# Altium project TimePi.PrjPcb
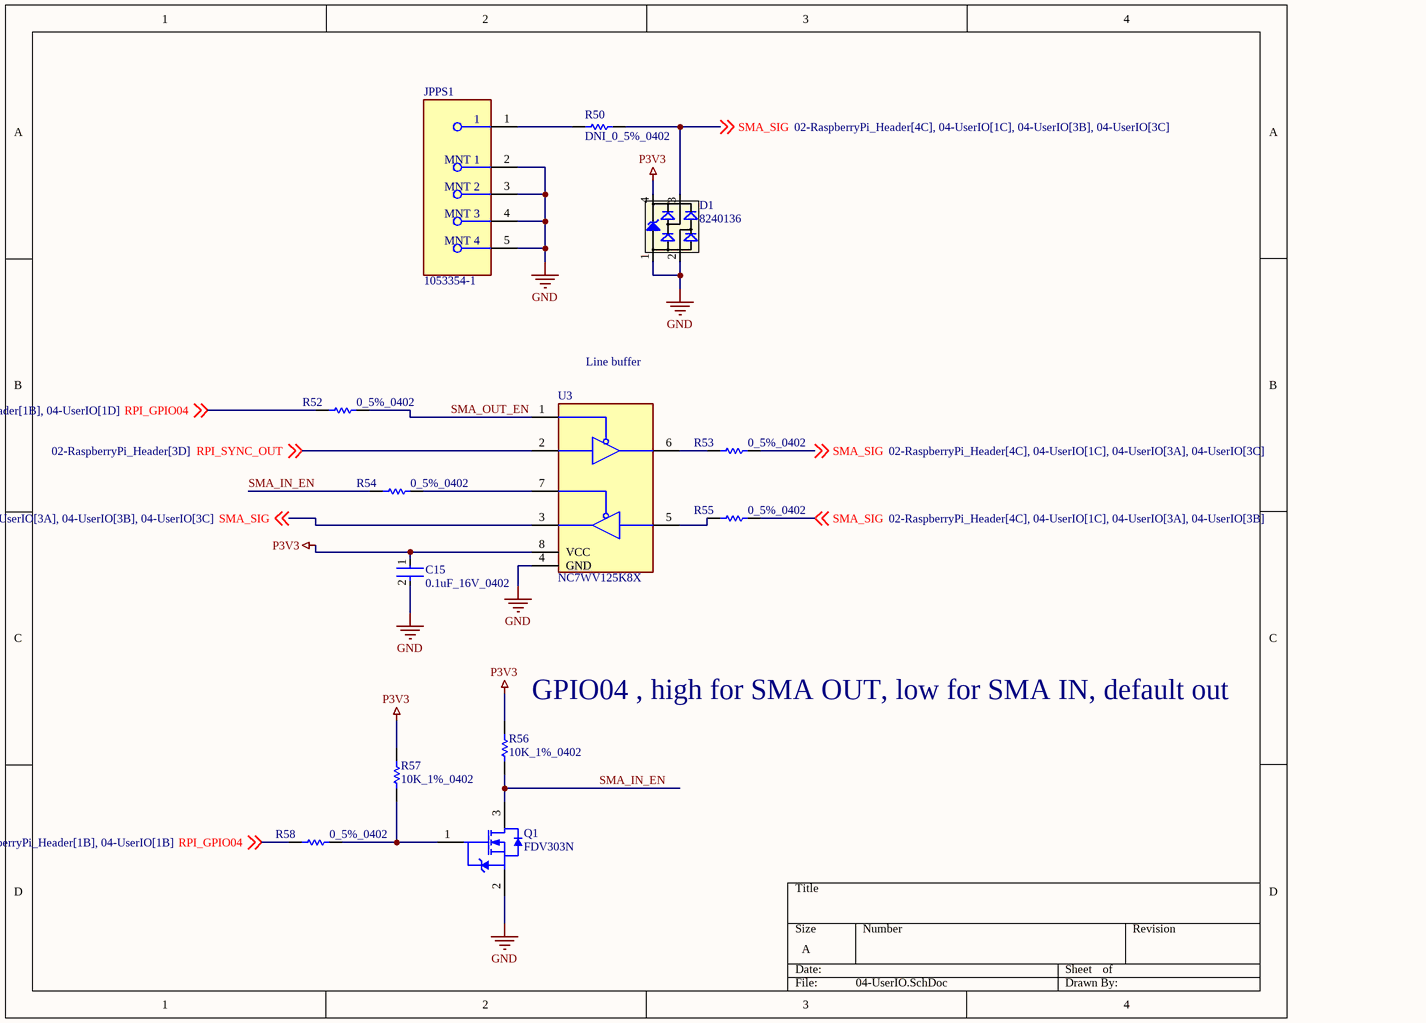
[diagram p0: 04-UserIO.SchDoc]
1 sheet, 13 parts. Net scope: global (net labels, ports and power ports of the same name join across sheets).
Board file: TimePi.PcbDoc

## Sheet 04-UserIO.SchDoc
size A; DocumentNumber: 4; SheetNumber: 4; SheetTotal: 4

### Parts
C15  0.1uF_16V_0402  [FP-GRM15-MFG]
D1  8240136  [SOT143-4L]
JPPS1  1053354-1  [FP-1053354-1-MFG]  (no BOM)
Q1  FDV303N  [FAIR-FDV303N-3_V]
R50  DNI_0_5%_0402  [RESC1005X40X25NL05T10]  (no BOM)
R52  0_5%_0402  [RESC1005X40X25NL05T10]
R53  0_5%_0402  [RESC1005X40X25NL05T10]
R54  0_5%_0402  [RESC1005X40X25NL05T10]
R55  0_5%_0402  [RESC1005X40X25NL05T10]
R56  10K_1%_0402  [RESC1005X40X25LL05T05]
R57  10K_1%_0402  [RESC1005X40X25LL05T05]
R58  0_5%_0402  [RESC1005X40X25NL05T10]
U3  NC7WV125K8X  [SOP50P310X90-8N]

### Nets
GND: C15.2 D1.1(GND) D1.2(I/O1) JPPS1.2(MNT_1) JPPS1.3(MNT_2) JPPS1.4(MNT_3) JPPS1.5(MNT_4) Q1.2(S) U3.4(GND)
P3V3: C15.1 D1.4(VDD) R56.2 R57.2 U3.8(VCC)
RPI_GPIO04: R52.1 R58.1 ; off-sheet RPI_GPIO04
RPI_SYNC_OUT: U3.2 ; off-sheet RPI_SYNC_OUT
SMA_IN_EN: Q1.3(D) R54.1 R56.1
SMA_OUT_EN: R52.2 U3.1
SMA_SIG: D1.3(I/O2) R50.1 R53.2 R55.2 U3.3 ; off-sheet SMA_SIG
NetJPPS1_1: JPPS1.1 R50.2
NetQ1_1: Q1.1(G) R57.1 R58.2
NetR53_1: R53.1 U3.6
NetR54_2: R54.2 U3.7
NetR55_1: R55.1 U3.5

### Notes on the sheet
- (near U3) Line buffer
- (near R56) GPIO04 , high for SMA OUT, low for SMA IN, default out

### Library data of the parts
C15 = CMP-2100-03641-2: CAP CER 0.1UF 16V X7R 0402; Manufacturer Part Number: GRM155R71C104KA88D; Manufacturer: Murata; Standoff Height: 0mm; Tolerance: 10%; Voltage Rating: 16Vdc; Material: Ceramic; Capacitance: 0.10μF; Value: 0.10μF; RoHS: TRUE; Temperature Characteristic: X7R; Octopart: https://octopart.com/grm155r71c104ka88d-murata-196880; Digikey Description: CAP CER 0.1UF 16V X7R 0402; Device Class L3: Ceramic Capacitors; Height: 0.55mm; ComponentLink2Description: Datasheet; Temperature Range Low: -55°C; Ipc Land Pattern Name: CAPC10050X219; ComponentLink2URL: https://search.murata.co.jp/Ceramy/image/img/A01X/G101/ENG/GRM155R71H471KA01-01A.pdf; Device Class L1: Passive Components; Lead Free: yes; Category: Cap; Package: GRM15; Temperature: -55°C to +125°C; Device Class L2: Capacitors; Temperature Range High: +125°C; Mouser Description: 0402 0.1 uF 16V ±10 % Tolerance X7R SMT Multilayer Ceramic Capacitor
D1 = CMP-1486-00002-1: TVS Diode WE-TVS-HS, VRWM=3.3V; Manufacturer: Wuerth Elektronik; Reverse Stand Off Voltage: 3.3V; PartNumber: 8240136; ComponentLink1Description: Manufacturer URL; PackageReference: SOT143-4L; ComponentLink1URL: http://www.we-online.com; ComponentLink2Description: Datasheet; ComponentLink2URL: http://katalog.we-online.de/kataloge/eisos/media/pdf/8240136.pdf
JPPS1 = CMP-2000-05830-2: CONN SMA JACK STR 50 OHM PCB; Dielectric Material: PTFE; Impedance: 50R; Frequency: 18GHz; Polarity: Normal; Body Material: Stainless Steel; Max Frequency: 12.4GHz; Center Contact Plating: Gold; PCB Mounting Orientation: Vertical; Mating Cycles: 500; Gender: Female; Number of Ports: 1; Packaging: Bag; Contact Plating: Gold; REACH SVHC: No SVHC; Radiation Hardening: No; Mount: Through Hole; Fastening Type: Threaded; Package Quantity: 125; Connector Type: SMA; Operating Frequency: N/A; Height: 9.5mm; Plating: Gold; RoHS Compliant: Yes; Insulation Material: Polytetrafluoroethylene; Length: 9.53mm; Contact Material: Copper; Orientation: Straight; Case/Package: SMA; Depth: 6.3mm; Series: SMA; Termination: Solder; Housing Color: Gold; Body Plating: Gold
Q1 = CMP-2000-05111-1: N-Channel MOSFET Transistor, 8 V VGSS, 25 V VDSS, 0.68 A, -55 to 150 degC, 3-Pin SOT23, RoHS, Tape and Reel; Manufacturer: Fairchild; Typical Turn-On Delay Time: 3ns; Channel Mode: Enhancement; RDS-on: 450@4.5VmOhm; Maximum Continuous Drain Current: 0.68A; Maximum Drain Source Voltage: 25V; Rad Hard: No; Typical Fall Time: 13ns; Channel Type: N; Typical Turn-Off Delay Time: 17ns; Maximum Gate Source Voltage: 8V; Typical Rise Time: 8.5ns; Mounting: SurfaceMount; Packaging: Tape&Reel; Manufacturer URL: https://www.fairchildsemi.com/; Datasheet URL: https://datasheet.ciiva.com/22681/1845307-22681736.pdf; Package: 3SOT-23; Category: MOSFET; Operating Temperature: -55to150degC; Datasheet Version: Rev. D2, 07/2014
R50 R52-R55 R58 = CMP-1011-00001-2: Manufacturer: Yageo / Phycomp; Part Number: RC0402JR-070RL
R56 R57 = CMP-2000-07588-1: Chip Resistor, 10 KOhm, +/- 1%, 0.1 W, -55 to 155 degC, 0402 (1005 Metric), RoHS, Tape and Reel; Manufacturer: Panasonic; Power Rating: 100mW; Voltage Rating: 50V; Resistance: 10KOhm; Case\/Package: 0402; Temperature Coefficient: 100ppm\/degreesC; RoHSCompliant: True; Lead Free: LeadFree; Package Quantity: 1; Contact Plating: Tin; Length: 1mm; Radiation Hardening: No; REACH SVHC: NoSVHC; Max Operating Temperature: 155degC; Depth: 0.5mm; Case Code (Imperial): 0402; Military Standard: Not; Package Description: 2-Pin Surface Mount Device, Body 1 x 0.5 mm; Termination: SMD/SMT; Case Code (Metric): 1005; Height: 0.35mm; Packaging: TapeandReel; Voltage Rating (DC): 50V; Package Reference: 402; Number of Pins: 2; Tolerance: 1%; Mounting Technology: SurfaceMount; Width: 0.02inch; Mount: SurfaceMount; Datasheet URL: https://industrial.panasonic.com/cdbs/www-data/pdf/RDA0000/AOA0000C304.pdf; Composition: ThickFilm; Datasheet Version: 02/2017; Manufacturer URL: http://www.panasonic.com/; Max Power Dissipation: 100mW; Number of Terminations: 2; Min Operating Temperature: -55degC
U3 = NC7WV125K8X: Integrated Circuit; Manufacturer_Name: ON Semiconductor; Datasheet Link: https://www.mouser.com/datasheet/2/308/NC7WV125-1301459.pdf; Height: 0.9mm; Manufacturer_Part_Number: NC7WV125K8X; Mouser Part Number: 512-NC7WV125K8X; Mouser Price/Stock: https://www.mouser.com/Search/Refine.aspx?Keyword=512-NC7WV125K8X; Arrow Part Number: NC7WV125K8X; Arrow Price/Stock: https://www.arrow.com/en/products/nc7wv125k8x/on-semiconductor